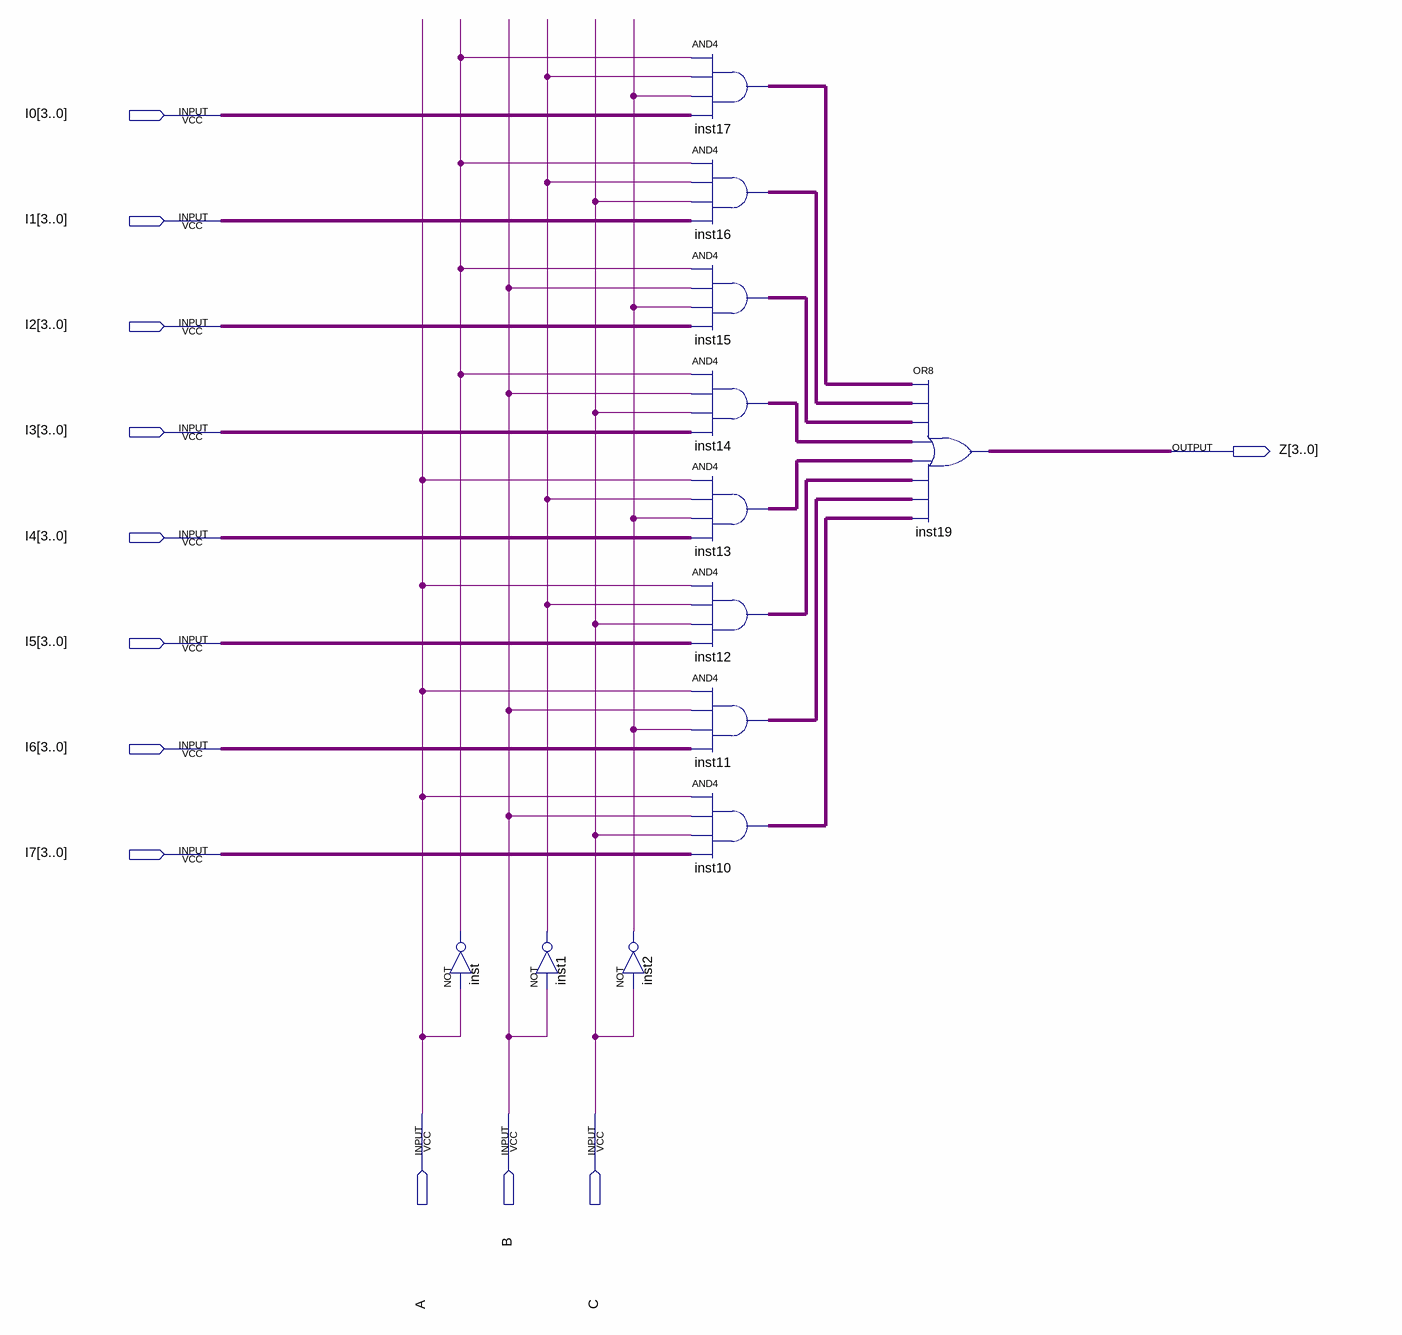
[diagram p0: schematic sheet]
// Quartus schematic MUX81.bdf as structural Verilog: 12 symbols, 12 pins
module MUX81 (
  input  [3:0] I0,
  input  [3:0] I1,
  input  [3:0] I2,
  input  [3:0] I3,
  input  [3:0] I4,
  input  [3:0] I5,
  input  [3:0] I6,
  input  [3:0] I7,
  input  A,
  input  B,
  input  C,
  output [3:0] Z
);

  wire inst1_out, inst2_out, inst_out;
  wire [3:0] inst10_out, inst11_out, inst12_out, inst13_out, inst14_out, inst15_out, inst16_out, inst17_out;

  not inst (inst_out, A);
  not inst1 (inst1_out, B);
  not inst2 (inst2_out, C);
  assign inst17_out = {4{inst_out}} & {4{inst1_out}} & {4{inst2_out}} & I0;  // AND4 inst17, 4 bits wide
  assign inst16_out = {4{inst_out}} & {4{inst1_out}} & {4{C}} & I1;  // AND4 inst16, 4 bits wide
  assign inst15_out = {4{inst_out}} & {4{B}} & {4{inst2_out}} & I2;  // AND4 inst15, 4 bits wide
  assign inst14_out = {4{inst_out}} & {4{B}} & {4{C}} & I3;  // AND4 inst14, 4 bits wide
  assign inst13_out = {4{A}} & {4{inst1_out}} & {4{inst2_out}} & I4;  // AND4 inst13, 4 bits wide
  assign inst12_out = {4{A}} & {4{inst1_out}} & {4{C}} & I5;  // AND4 inst12, 4 bits wide
  assign inst11_out = {4{A}} & {4{B}} & {4{inst2_out}} & I6;  // AND4 inst11, 4 bits wide
  assign inst10_out = {4{A}} & {4{B}} & {4{C}} & I7;  // AND4 inst10, 4 bits wide
  assign Z = inst17_out | inst16_out | inst15_out | inst14_out | inst13_out | inst12_out | inst11_out | inst10_out;  // OR8 inst19, 4 bits wide
endmodule
